# EAGLE schematic Projeto Lora (EAGLE 9.6.2)
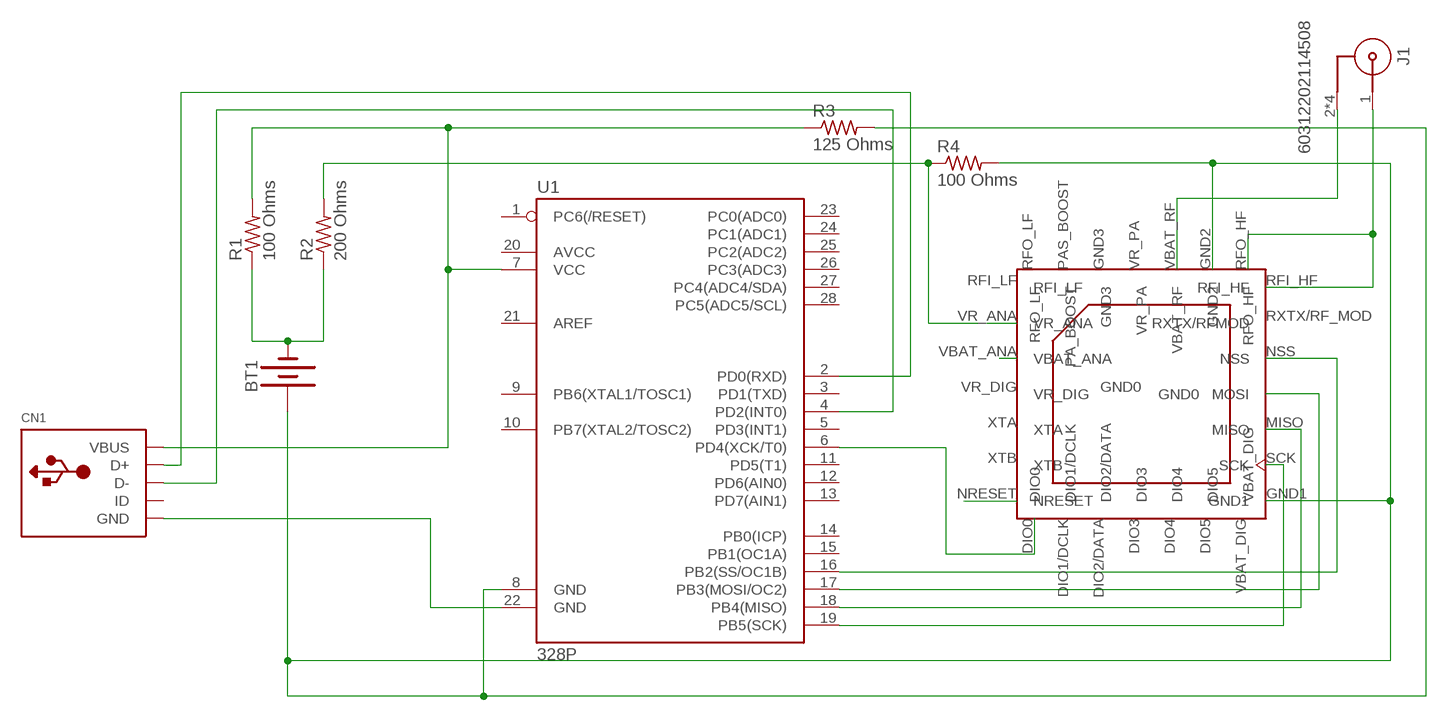
[diagram p0: schematic, sheet 1]

## Parts
BT1  BATTERY-9V  [BATTCON_9V]
CN1  USBMINIB  [USB-MINIB]
J1  60312202114508  [60312202114508]
R1  100 Ohms  R-US_01005  [R01005]
R2  200 Ohms  R-US_01005  [R01005]
R3  125 Ohms  R-US_01005  [R01005]
R4  100 Ohms  R-US_01005  [R01005]
U1  328P  ATMEGA328P_PDIP  [DIP28]
U$1  LORA-SX1278  [PDIP]

## Nets
N$1: U$1.NRESET
N$2: U1.6(PD4(XCK/T0)) U$1.DIO0
N$3: U1.19(PB5(SCK)) U$1.SCK
N$4: U1.18(PB4(MISO)) U$1.MISO
N$5: U1.17(PB3(MOSI/OC2)) U$1.MOSI
N$6: U1.16(PB2(SS/OC1B)) U$1.NSS
N$7: J1.1 U$1.RFI_HF U$1.RFO_HF
N$8: CN1.VBUS R1.2 R3.1 U1.7(VCC)
N$9: R2.2 R4.1 U$1.VR_ANA
N$10: J1.2 J1.3 J1.4 J1.5 U$1.VBAT_RF
N$11: BT1.- R1.1 R2.1
N$12: BT1.+ R3.2 R4.2 U1.8(GND) U$1.GND1 U$1.GND2
N$13: U$1.VBAT_ANA
N$14: CN1.GND U1.22(GND)
N$15: CN1.D+ U1.2(PD0(RXD))
N$16: CN1.D- U1.4(PD2(INT0))
Unconnected: CN1.ID U1.1(PC6(/RESET)) U1.3(PD1(TXD)) U1.5(PD3(INT1)) U1.9(PB6(XTAL1/TOSC1)) U1.10(PB7(XTAL2/TOSC2)) U1.11(PD5(T1)) U1.12(PD6(AIN0)) U1.13(PD7(AIN1)) U1.14(PB0(ICP)) U1.15(PB1(OC1A)) U1.20(AVCC) U1.21(AREF) U1.23(PC0(ADC0)) U1.24(PC1(ADC1)) U1.25(PC2(ADC2)) U1.26(PC3(ADC3)) U1.27(PC4(ADC4/SDA)) U1.28(PC5(ADC5/SCL)) U$1.DIO1/DCLK U$1.DIO2/DATA U$1.DIO3 U$1.DIO4 U$1.DIO5 U$1.PAS_BOOST(PA_BOOST) U$1.RFI_LF U$1.RFO_LF U$1.RXTX/RF_MOD(RXTX/RFMOD) U$1.XTA U$1.XTB

## Power pins joined to a net without a drawn wire
GND0: U$1.GND0
GND3: U$1.GND3
VBAT_DIG: U$1.VBAT_DIG
VR_DIG: U$1.VR_DIG
VR_PA: U$1.VR_PA

## Library data of the parts
BT1 = SparkFun-Batteries:BATTERY: Battery - Single Cell A variety of battery chemistries, sizes, and footprints. Device List: 20MM_PTH - Coin Cell Battery Holder - 20mm (PTH) <https://www.sparkfun.com/products/783> 6.8MM_PTH - Coin Cell Battery Holder - 6.8MM(SMD) <https://www.digikey.com/product-detail/en/seiko-instruments/MS621FE-FL11E/728-1057-ND/1889208?WT.srch=1&gclid=CNOQ5a6LzdQCFZS2wAodXCkE0g> 12MM_SMD - Coin Cell Battery Holder - 12mm (SMD) <https://www.sparkfun.com/products/10592> 12MM_PTH - Coin Cell Battery Holder - 12mm (PTH) <https://www.sparkfun.com/products/7948> 20MM_SMD - 20mm Coin Cell Battery Holder (SMD) (2 legs) Used on the Big Time Watch Kit <https://www.sparkfun.com/products/11734> 20MM_SMD_4LEGS - Coin Cell Battery Holder - 20mm (SMD) <https://www.sparkfun.com/products/11892> 20MM_SMD_4LEGS_OVERPASTE - Coin Cell Battery Holder - 20mm (SMD) <https://www.sparkfun.com/products/11892> (Over-paste on the legs) 24.5MM_PTH - Coin Cell Battery Holder - 24.5mm (PTH) <https://www.sparkfun.com/products/8863> 9V - 9V Battery Holder - PC Mount Used on the SparkFun SparkPunk Sound Kit <https://www.sparkfun.com/products/11177> and SparkFun SparkPunk Sequencer Kit <https://www.sparkfun.com/products/12707> 18650 - Battery Holder - 18650 (PTH) <https://www.sparkfun.com/products/13113> AA - Battery Holder - 1xAA (PTH) <https://www.sparkfun.com/products/7949> AAA - Battery Holder - 1xAAA (PTH) <https://www.sparkfun.com/products/12718> AA_KIT - Battery Holder - 1xAA (PTH) <https://www.sparkfun.com/products/7949> Special kit package - pads only have exposed copper on one side of the board. AAA_KIT - Battery Holder - 1xAAA (PTH) <https://www.sparkfun.com/products/12718> Special kit package - pads only have exposed copper on one side of the board.; PROD_ID: BATT-10855
CN1 = adafruit:USB: USB Connectors USBMINIB - Surface Mount Female Mini-B USB Connector 4UConnector: 06564 By microbuilder.eu Thru-hole RA Female Mini-B USB Connector 4UConnector: 18732 By ladyada.net
J1 = 60312202114508:60312202114508: WR-SMA PCB End Launch Jack Round Post 1.1 mm MATERIAL PROPERTIES Insulator Material PTFE Insulator Color White Center Contact Material Beryllium Copper Center Contact Plating Gold, min. 0.76µm over Nickel Body Material Brass Body Plating Gold, min. 0.076µm over Nickel KIND PROPERTIES Interface MIL-STD-348 Connector Type SMA Gender Jack Orientation Type Straight GENERAL INFORMATION: Operating Temperature -65 °C up to +165 °C Compliance RoHS ELECTRICAL PROPERTIES Frequency Range DC~18 GHz MECHANICAL PROPERTIES Mating Cycle 500 Cycles PACKAGING PROPERTIES Packaging Tray <https://katalog.we-online.com/media/images/v2/o122847v209%20WR-SMA_60312202114508.jpg> Details see: https://katalog.we-online.com/en/em/WR-SMA_60312202114508 Updated by Ella Wu, 2019-11-07 2019(C) Würth Elektronik Check prices <https://pricing.snapeda.com/parts/60312202114508/W%C3%BCrth%20Elektronik/view-part?ref=eda>; AVAILABILITY: In Stock; DESCRIPTION: SMA Connector Jack, Female Socket 50Ohm Board Edge, End Launch Solder; MF: Würth Elektronik; MP: SMA Connector; PACKAGE: None; PRICE: None; PURCHASE-URL: https://pricing.snapeda.com/search/part/60312202114508/?ref=eda
R1-R4 = resistor:R-US_: RESISTOR, American symbol
U1 = SparkFun-IC-Microcontroller:ATMEGA328P_PDIP: Atmel 328P Through hole ATMEGA328P uC used in the Arduino 32kb flash, 1k EEPROM, 2k SRAM Datasheet <http://www.sparkfun.com/datasheets/Components/SMD/ATMega328.pdf> SparkFun Products Storefront component: AVR 28 Pin 20MHz 32K 6A/D - ATMega328P <https://www.sparkfun.com/products/9061> (COM-09061) SparkFun Simon Says - Through-Hole Soldering Kit <https://www.sparkfun.com/products/10547> (KIT-10547) SparkFun Learn to Solder - Simon Says <https://www.sparkfun.com/products/13708> (KIT-13708) SparkFun BigTime Watch Kit <https://www.sparkfun.com/products/11734> (KIT-11734) SparkFun ClockIt <https://www.sparkfun.com/products/10930> (KIT-10930) SparkFun Serial Enabled LCD Kit <https://www.sparkfun.com/products/10097> (LCD-10097) SparkFun Simon Tilts - Through Hole Soldering Kit <https://www.sparkfun.com/products/12634> (KIT-12634) SparkFun Frequency Counter Kit <https://www.sparkfun.com/products/10140> (KIT-10140) FabFM Radio Kit <https://www.sparkfun.com/products/11043> (KIT-11043) SparkFun Binary Blaster Kit <https://www.sparkfun.com/products/12037> (KIT-12037) SparkFun Metro-Gnome <https://www.sparkfun.com/products/9236> (KIT-09236) ATmega328 with Arduino Optiboot (Uno) <https://www.sparkfun.com/products/10524> (DEV-10524); PROD_ID: IC-09136
U$1 = SX1278:LORA-SX1278: SX1278IMLTRT